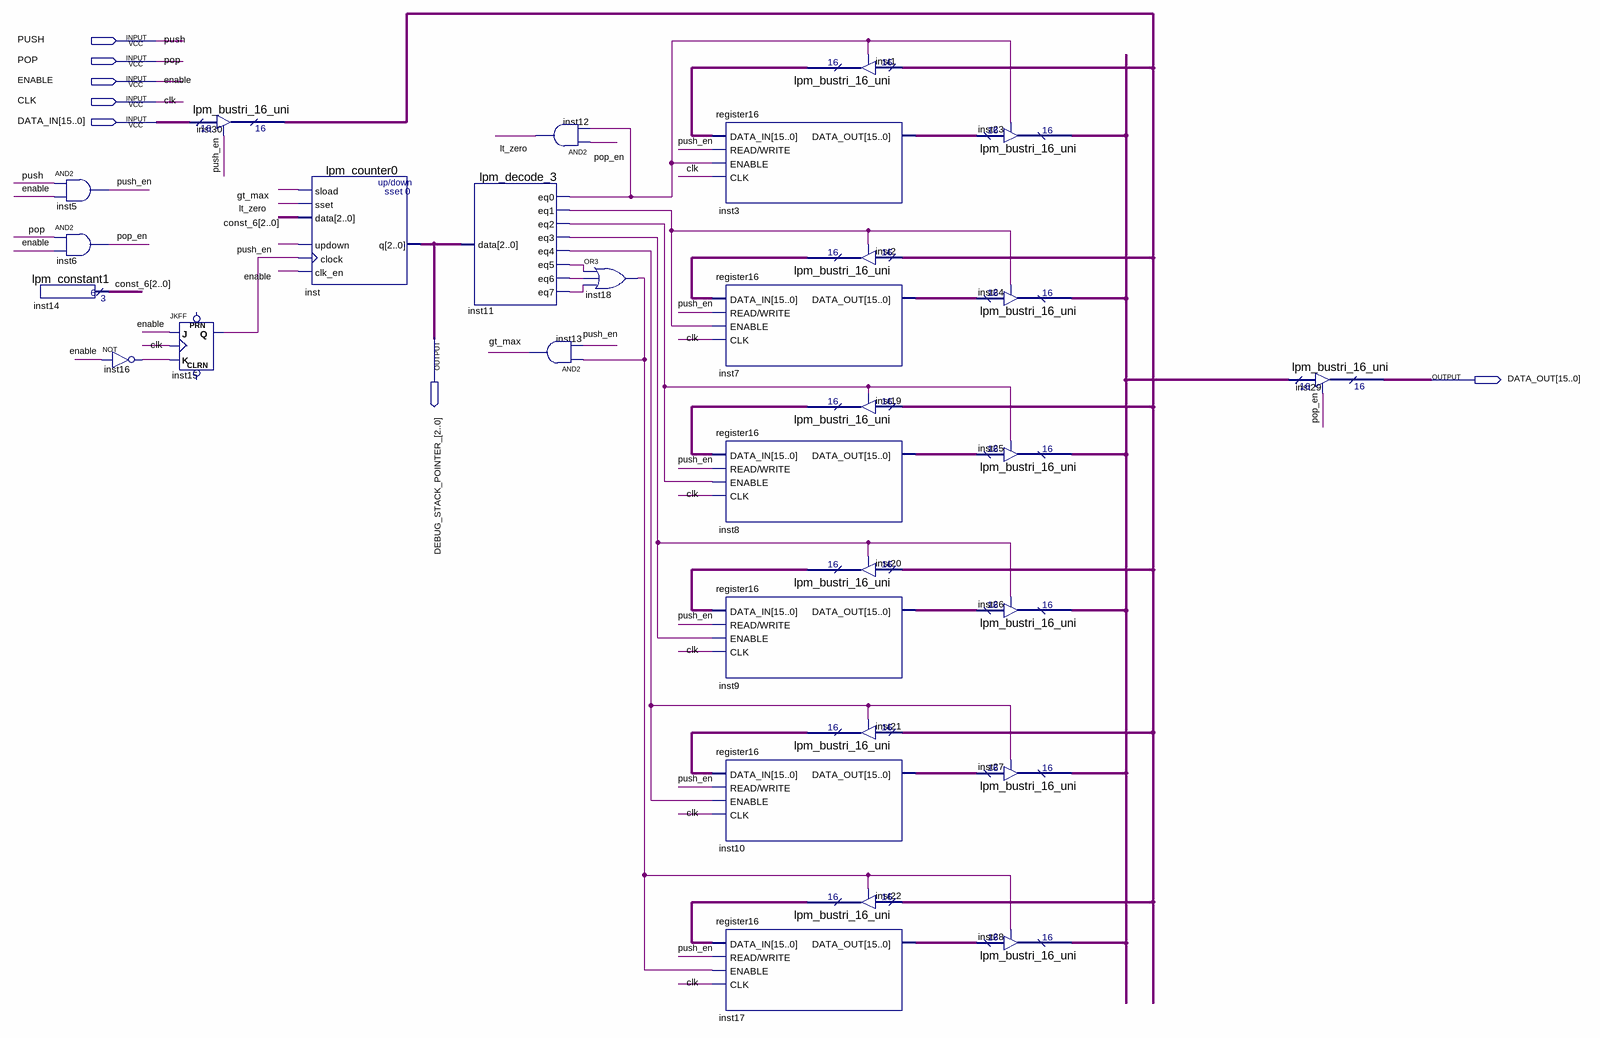
[diagram p0: schematic sheet]
// Quartus schematic stack.bdf as structural Verilog: 30 symbols, 7 pins
module stack (
  input  PUSH,
  input  POP,
  input  ENABLE,
  input  CLK,
  input  [15:0] DATA_IN,
  output [2:0] DEBUG_STACK_POINTER_,
  output [15:0] DATA_OUT
);

  wire gt_max, inst11_eq0, inst11_eq1, inst11_eq2, inst11_eq3, inst11_eq4, inst11_eq5, inst11_eq6,
       inst11_eq7, inst15_q, inst16_out, inst18_out, lt_zero, pop_en, push_en;
  wire [2:0] const_6;
  wire [15:0] inst1_tridata, inst2_tridata, inst3_data_out, inst7_data_out, inst8_data_out, inst9_data_out,
       inst10_data_out, inst17_data_out, inst19_tridata, inst20_tridata, inst21_tridata, inst22_tridata,
       inst23_tridata, inst30_tridata;

  lpm_constant1 inst14 (.result(const_6));
  and inst5 (push_en, PUSH, ENABLE);
  and inst6 (pop_en, POP, ENABLE);
  not inst16 (inst16_out, ENABLE);
  lpm_bustri_16_uni inst30 (.enabledt(push_en), .data(DATA_IN), .tridata(inst30_tridata));
  JKFF inst15 (.K(inst16_out), .J(ENABLE), .CLK(CLK), .Q(inst15_q));  // open: PRN, CLRN
  lpm_counter0 inst (
    .sload(gt_max), .sset(lt_zero), .data(const_6), .updown(push_en), .clock(inst15_q), .clk_en(ENABLE),
    .q(DEBUG_STACK_POINTER_));
  lpm_decode_3 inst11 (
    .data(DEBUG_STACK_POINTER_), .eq0(inst11_eq0), .eq1(inst11_eq1), .eq2(inst11_eq2), .eq3(inst11_eq3),
    .eq4(inst11_eq4), .eq5(inst11_eq5), .eq6(inst11_eq6), .eq7(inst11_eq7));
  and inst12 (lt_zero, pop_en, inst11_eq0);
  and inst13 (gt_max, inst18_out, push_en);
  or inst18 (inst18_out, inst11_eq5, inst11_eq6, inst11_eq7);
  register16 inst3 (
    .DATA_IN(inst1_tridata), .\READ/WRITE (push_en), .ENABLE(inst11_eq0), .CLK(CLK), .DATA_OUT(inst3_data_out));
  register16 inst7 (
    .DATA_IN(inst2_tridata), .\READ/WRITE (push_en), .ENABLE(inst11_eq1), .CLK(CLK), .DATA_OUT(inst7_data_out));
  register16 inst8 (
    .DATA_IN(inst19_tridata), .\READ/WRITE (push_en), .ENABLE(inst11_eq2), .CLK(CLK),
    .DATA_OUT(inst8_data_out));
  register16 inst9 (
    .DATA_IN(inst20_tridata), .\READ/WRITE (push_en), .ENABLE(inst11_eq3), .CLK(CLK),
    .DATA_OUT(inst9_data_out));
  register16 inst10 (
    .DATA_IN(inst21_tridata), .\READ/WRITE (push_en), .ENABLE(inst11_eq4), .CLK(CLK),
    .DATA_OUT(inst10_data_out));
  register16 inst17 (
    .DATA_IN(inst22_tridata), .\READ/WRITE (push_en), .ENABLE(inst18_out), .CLK(CLK),
    .DATA_OUT(inst17_data_out));
  lpm_bustri_16_uni inst1 (.enabledt(inst11_eq0), .data(inst30_tridata), .tridata(inst1_tridata));
  lpm_bustri_16_uni inst2 (.enabledt(inst11_eq1), .data(inst30_tridata), .tridata(inst2_tridata));
  lpm_bustri_16_uni inst19 (.enabledt(inst11_eq2), .data(inst30_tridata), .tridata(inst19_tridata));
  lpm_bustri_16_uni inst20 (.enabledt(inst11_eq3), .data(inst30_tridata), .tridata(inst20_tridata));
  lpm_bustri_16_uni inst21 (.enabledt(inst11_eq4), .data(inst30_tridata), .tridata(inst21_tridata));
  lpm_bustri_16_uni inst22 (.enabledt(inst18_out), .data(inst30_tridata), .tridata(inst22_tridata));
  lpm_bustri_16_uni inst23 (.enabledt(inst11_eq0), .data(inst3_data_out), .tridata(inst23_tridata));
  lpm_bustri_16_uni inst24 (.enabledt(inst11_eq1), .data(inst7_data_out), .tridata(inst23_tridata));
  lpm_bustri_16_uni inst25 (.enabledt(inst11_eq2), .data(inst8_data_out), .tridata(inst23_tridata));
  lpm_bustri_16_uni inst26 (.enabledt(inst11_eq3), .data(inst9_data_out), .tridata(inst23_tridata));
  lpm_bustri_16_uni inst27 (.enabledt(inst11_eq4), .data(inst10_data_out), .tridata(inst23_tridata));
  lpm_bustri_16_uni inst28 (.enabledt(inst18_out), .data(inst17_data_out), .tridata(inst23_tridata));
  lpm_bustri_16_uni inst29 (.enabledt(pop_en), .data(inst23_tridata), .tridata(DATA_OUT));
endmodule
